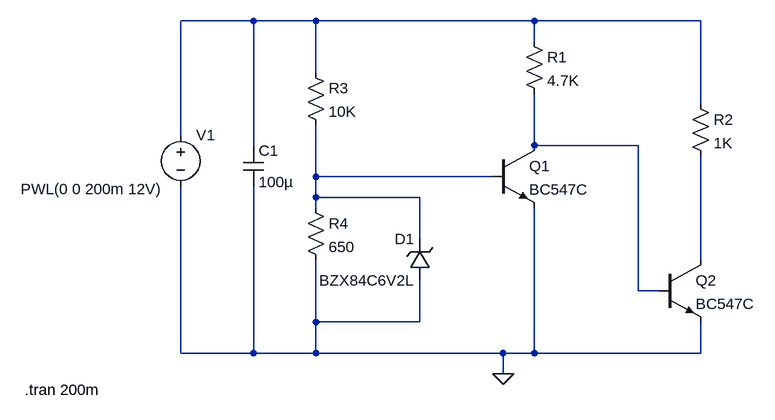
[diagram p0: schematic NPN.asc]
NPN.asc, the LTspice schematic file:
Version 4.1
SHEET 1 880 680
WIRE -208 -144 -320 -144
WIRE -112 -144 -208 -144
WIRE 224 -144 -112 -144
WIRE 480 -144 224 -144
WIRE 224 -112 224 -144
WIRE -112 -64 -112 -144
WIRE 480 -16 480 -144
WIRE -320 32 -320 -144
WIRE -208 48 -208 -144
WIRE 224 48 224 -32
WIRE 384 48 224 48
WIRE -112 96 -112 16
WIRE 160 96 -112 96
WIRE -112 128 -112 96
WIRE 48 128 -112 128
WIRE -112 144 -112 128
WIRE 48 192 48 128
WIRE 480 224 480 64
WIRE 384 272 384 48
WIRE 416 272 384 272
WIRE -112 320 -112 224
WIRE 48 320 48 256
WIRE 48 320 -112 320
WIRE -320 368 -320 112
WIRE -208 368 -208 112
WIRE -208 368 -320 368
WIRE -112 368 -112 320
WIRE -112 368 -208 368
WIRE 176 368 -112 368
WIRE 224 368 224 144
WIRE 224 368 176 368
WIRE 480 368 480 320
WIRE 480 368 224 368
WIRE 176 400 176 368
FLAG 176 400 0
SYMBOL res 208 -128 R0
SYMATTR InstName R1
SYMATTR Value 4.7K
SYMATTR SpiceLine tol=1 pwr=0.1
SYMBOL res 464 -32 R0
SYMATTR InstName R2
SYMATTR Value 1K
SYMATTR SpiceLine tol=1 pwr=0.1
SYMBOL res -128 -80 R0
SYMATTR InstName R3
SYMATTR Value 10K
SYMATTR SpiceLine tol=1 pwr=0.1
SYMBOL res -128 128 R0
SYMATTR InstName R4
SYMATTR Value 650
SYMATTR SpiceLine tol=1 pwr=0.1
SYMBOL npn 160 48 R0
SYMATTR InstName Q1
SYMATTR Value BC547C
SYMBOL npn 416 224 R0
SYMATTR InstName Q2
SYMATTR Value BC547C
SYMBOL voltage -320 16 R0
WINDOW 3 -246 99 Left 2
WINDOW 123 0 0 Left 0
WINDOW 39 0 0 Left 0
SYMATTR InstName V1
SYMATTR Value PWL(0 0 200m 12V)
SYMBOL zener 64 256 R180
WINDOW 0 24 64 Left 2
WINDOW 3 24 0 Left 2
SYMATTR InstName D1
SYMATTR Value BZX84C6V2L
SYMBOL cap -224 48 R0
WINDOW 3 24 56 Left 2
SYMATTR InstName C1
SYMATTR Value 100µ
SYMATTR Description Capacitor
SYMATTR Type cap
SYMATTR SpiceLine V=6.3 Irms=0 Rser=0.9 Lser=0 mfg="AVX" pn="TAJD107M006" type="Tantalum"
TEXT -560 424 Left 2 !.tran 200m

The netlist it stands for:
* NPN.asc
R1 N001 N002 4.7K tol=1 pwr=0.1
R2 N001 N004 1K tol=1 pwr=0.1
R3 N001 N003 10K tol=1 pwr=0.1
R4 N003 0 650 tol=1 pwr=0.1
Q1 N002 N003 0 0 BC547C
Q2 N004 N002 0 0 BC547C
V1 N001 0 PWL(0 0 200m 12V)
D1 0 N003 BZX84C6V2L
C1 N001 0 100µ V=6.3 Irms=0 Rser=0.9 Lser=0 mfg="AVX" pn="TAJD107M006" type="Tantalum"
.model D D
.lib standard.dio
.model NPN NPN
.model PNP PNP
.lib standard.bjt
.tran 200m
.backanno
.end